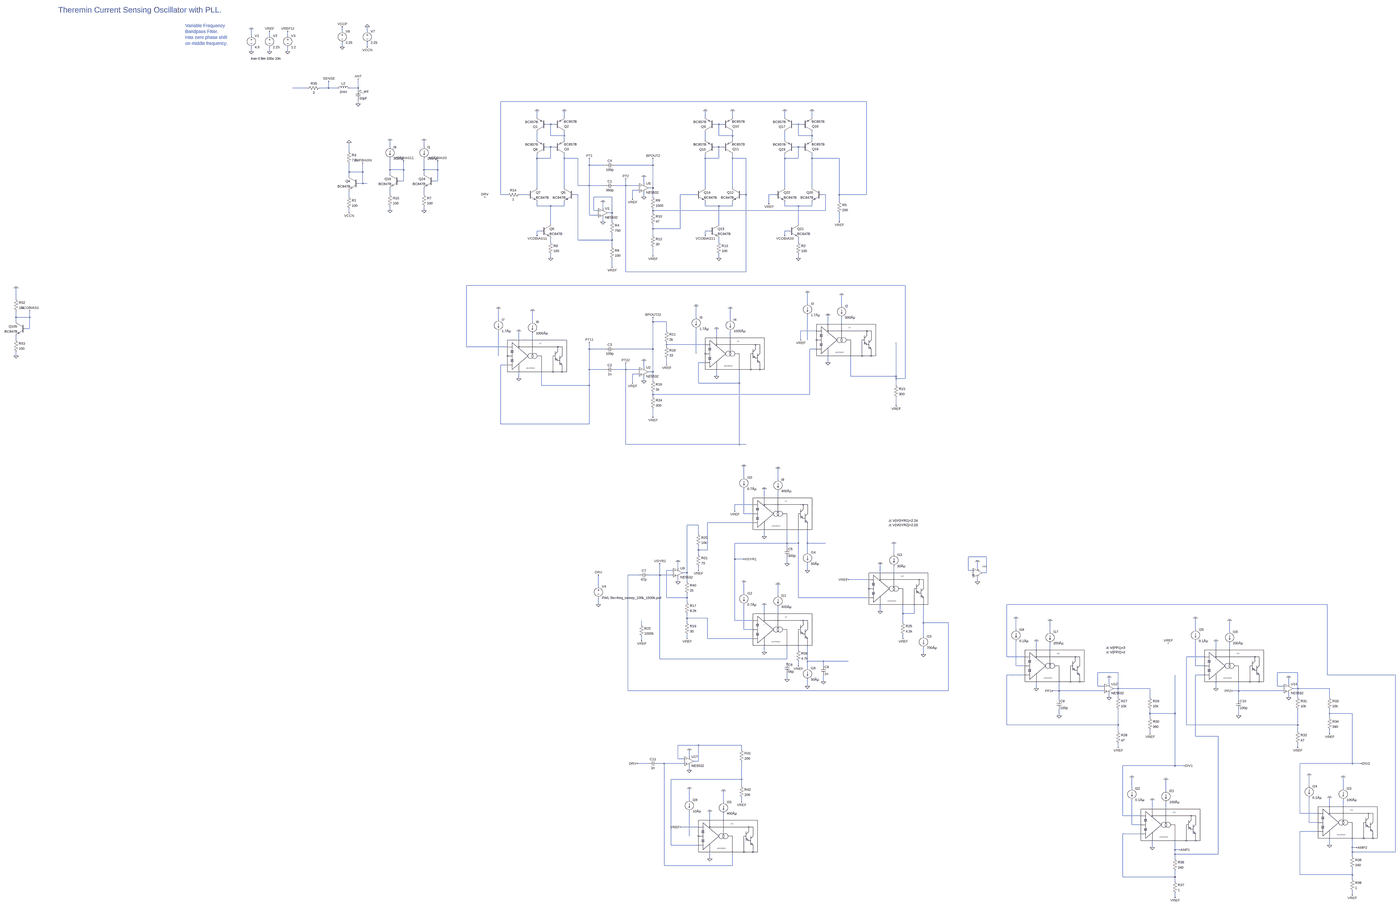
[diagram p0: schematic vco_and_lc_drive_v12.asc, whole sheet]
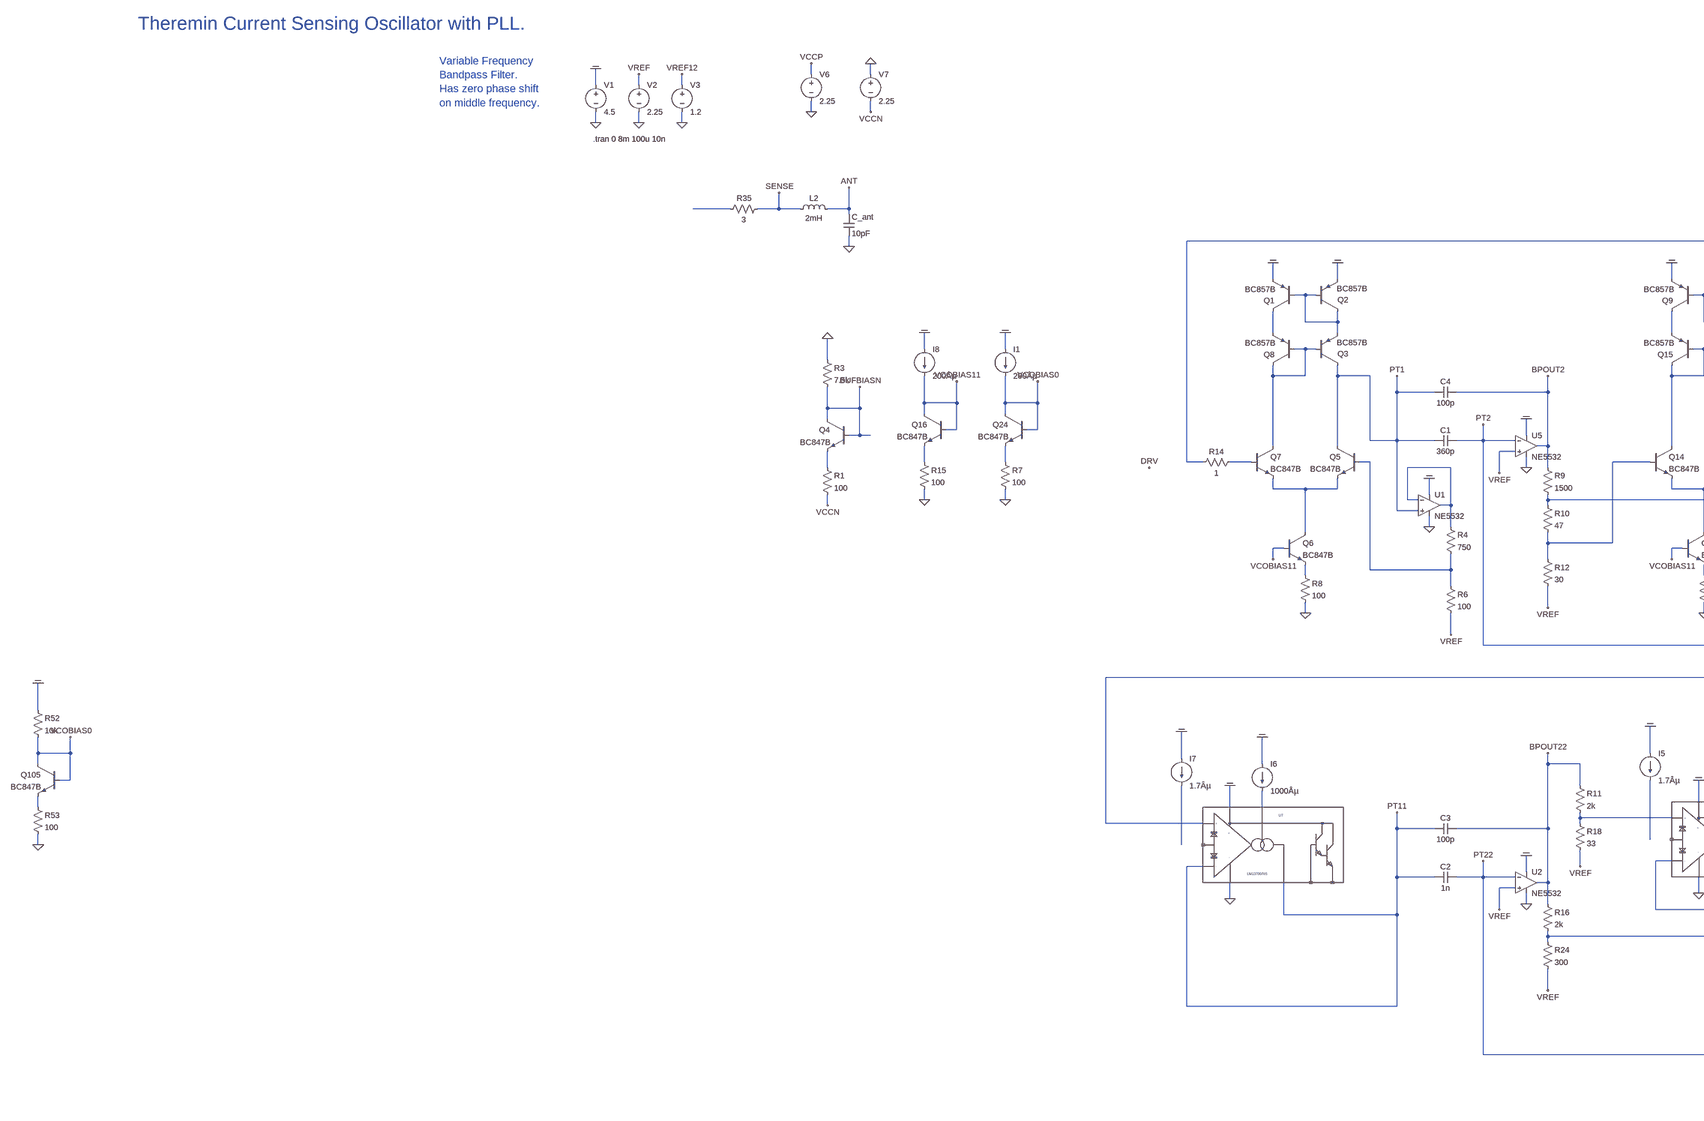
[diagram p1: schematic vco_and_lc_drive_v12.asc, part, row 1 of 2, column 1 of 2]
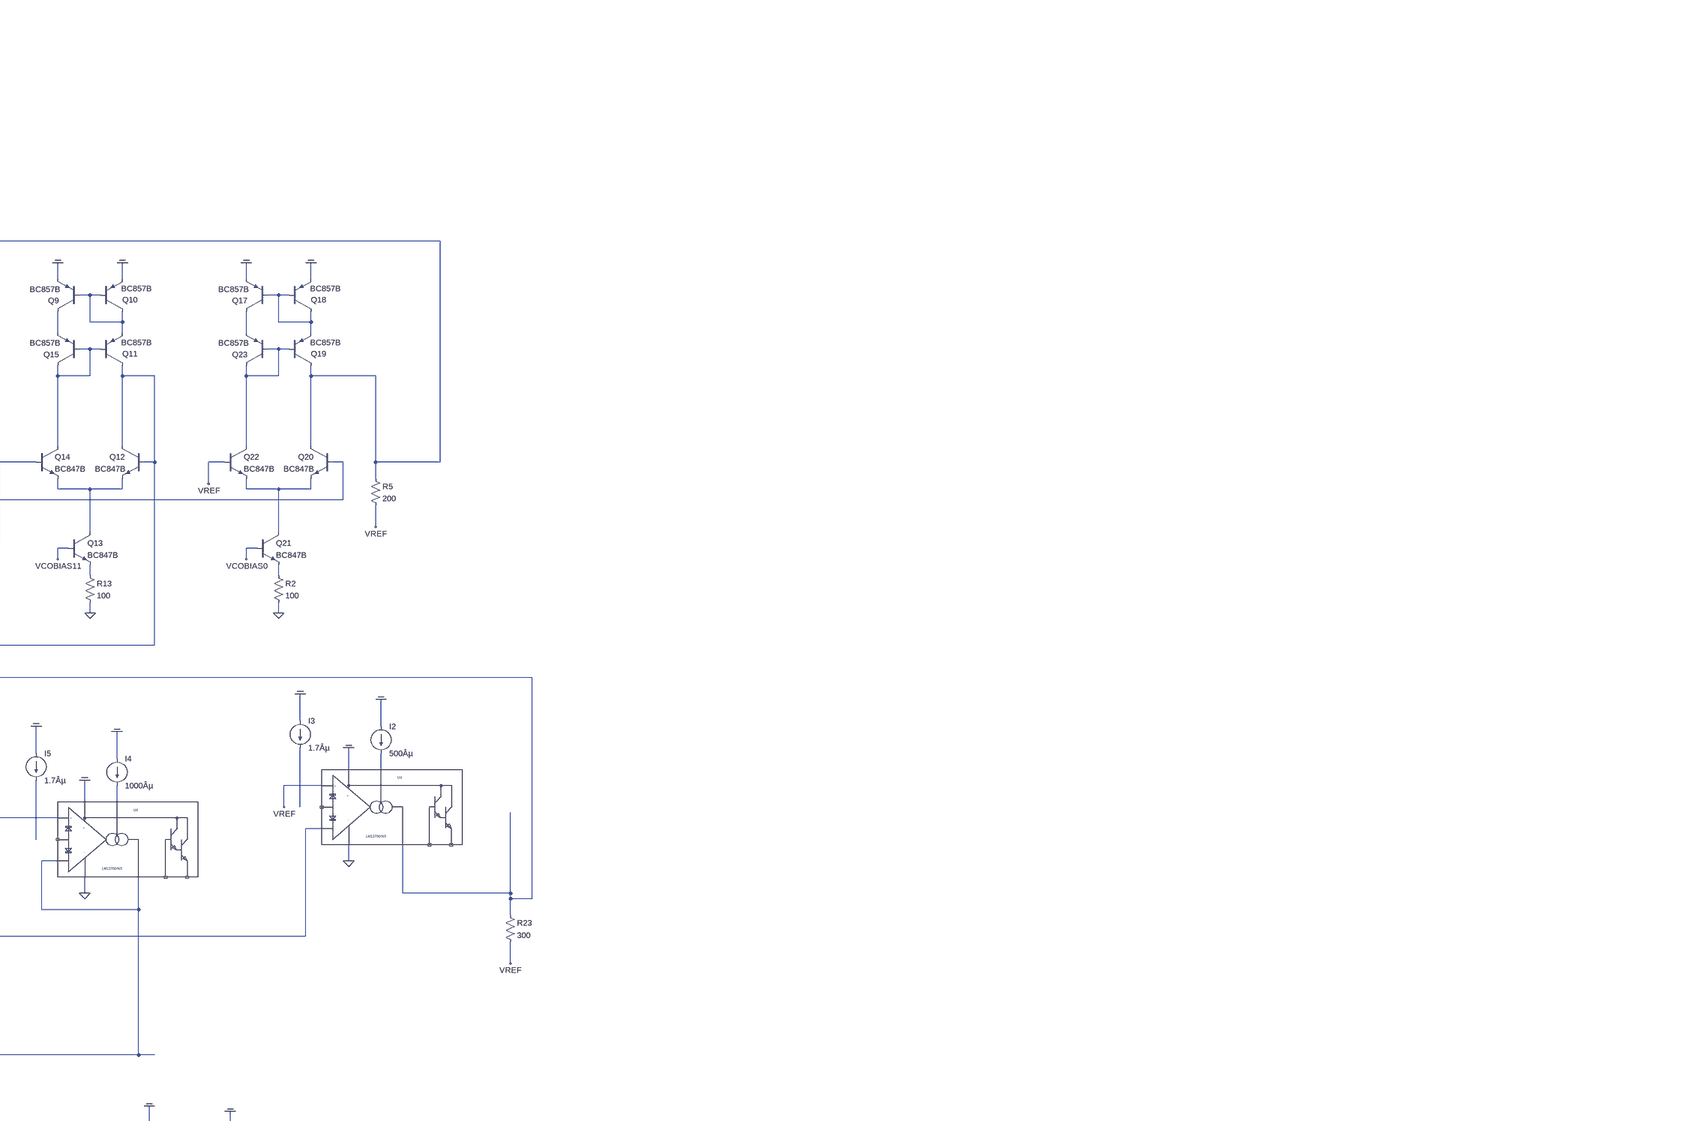
[diagram p2: schematic vco_and_lc_drive_v12.asc, part, row 1 of 2, column 2 of 2]
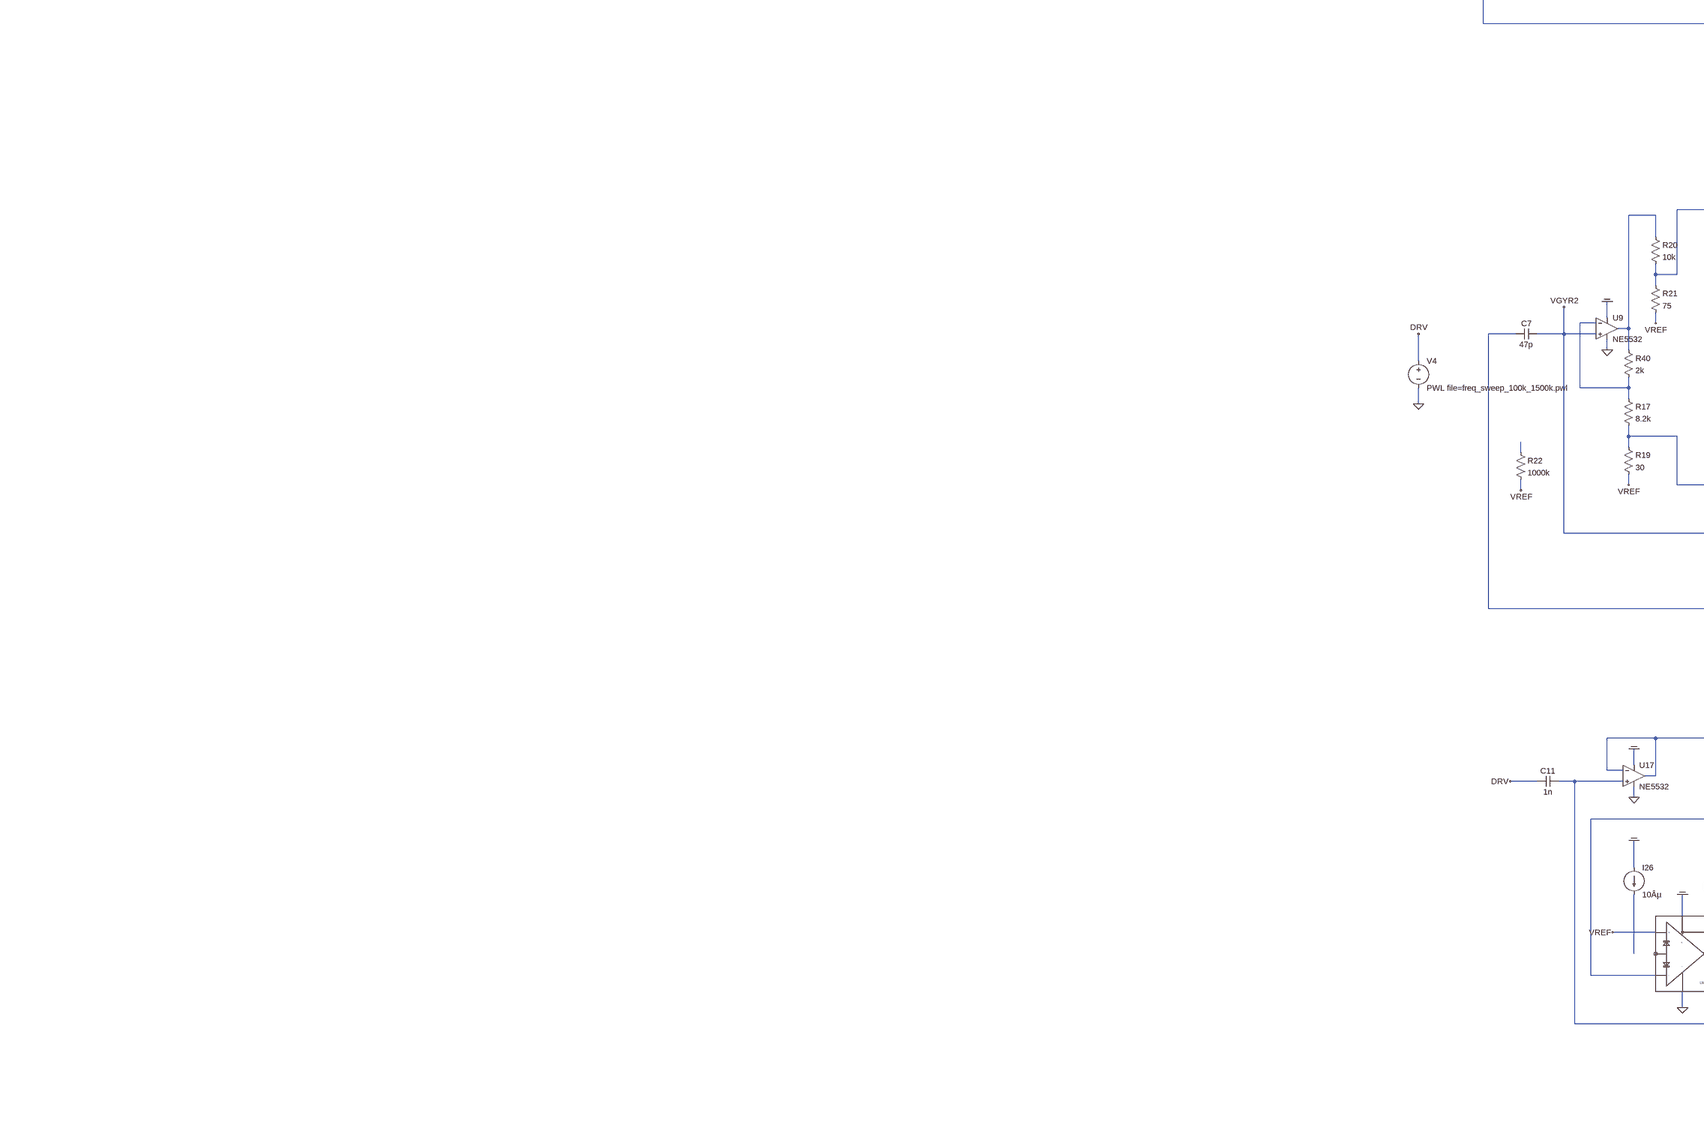
[diagram p3: schematic vco_and_lc_drive_v12.asc, part, row 2 of 2, column 1 of 2]
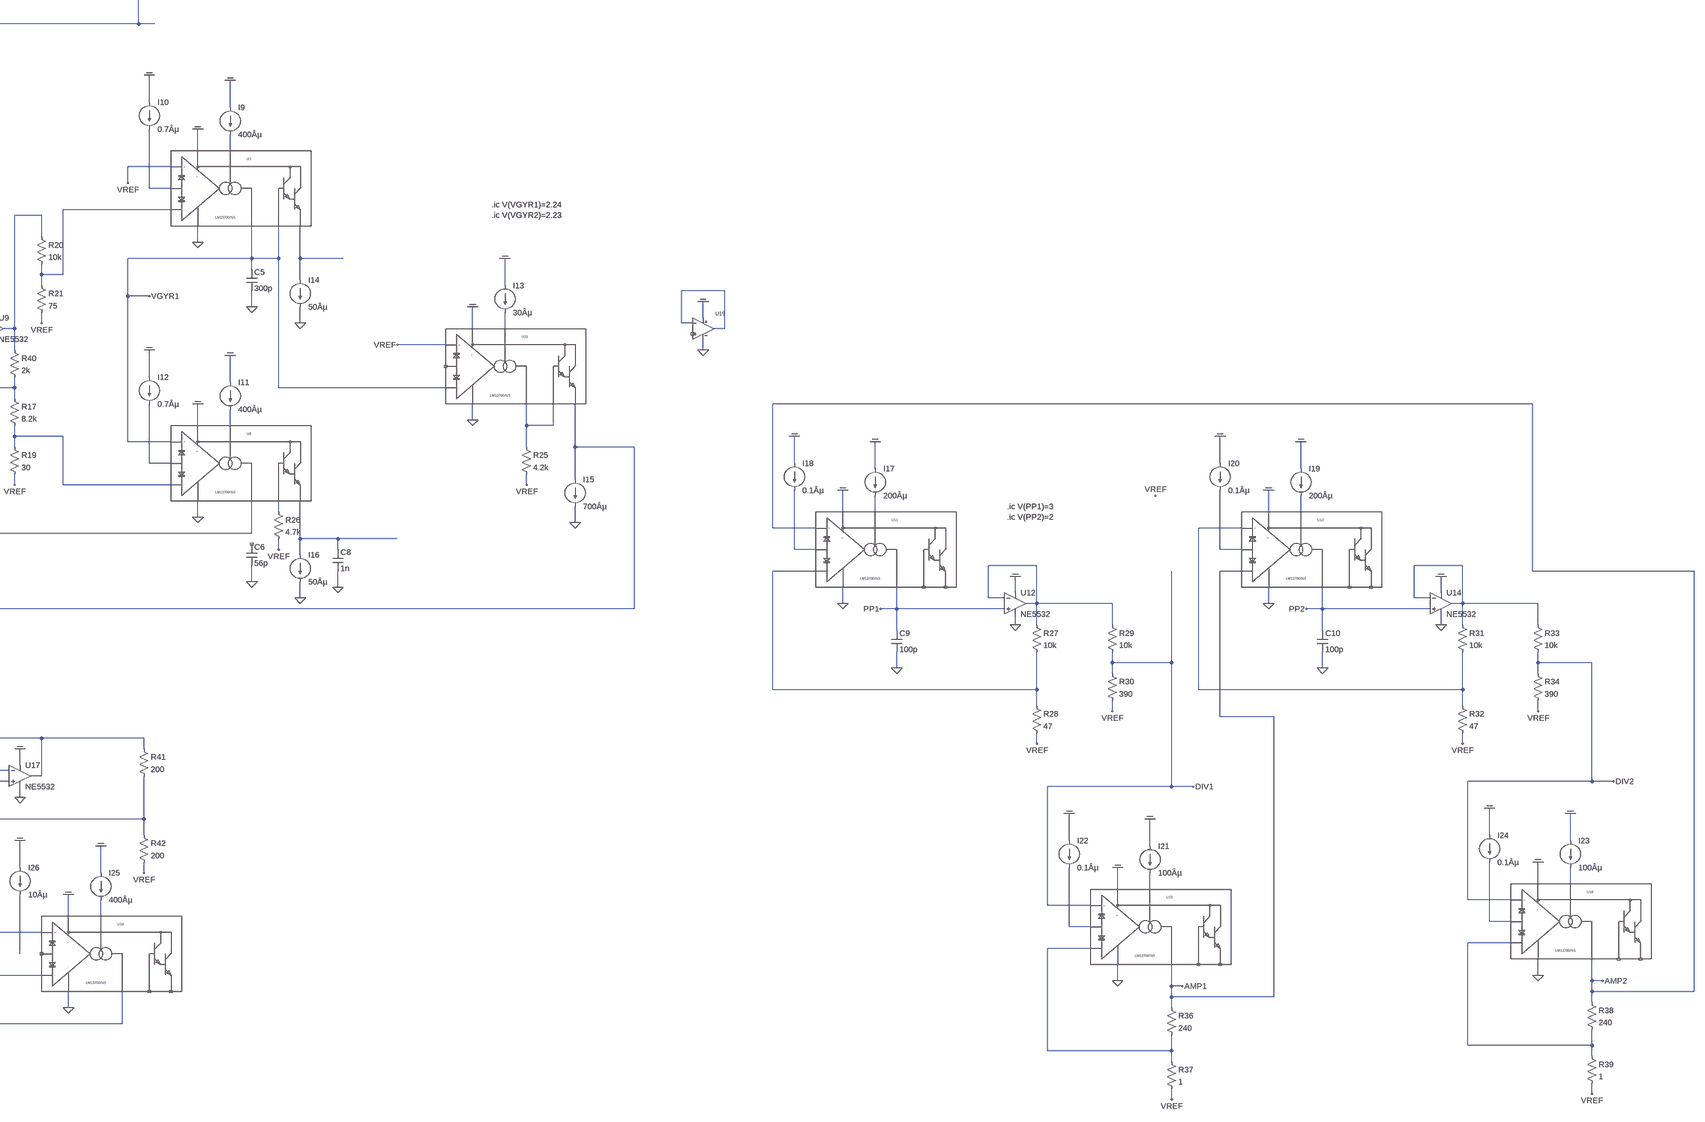
[diagram p4: schematic vco_and_lc_drive_v12.asc, part, row 2 of 2, column 2 of 2]
vco_and_lc_drive_v12.asc, the LTspice schematic file:
Version 4
SHEET 1 13504 25532
WIRE -4960 19040 -4960 19008
WIRE -4784 19040 -4784 19008
WIRE -5600 19072 -5600 19024
WIRE -5472 19072 -5472 19040
WIRE -5344 19072 -5344 19040
WIRE -4960 19152 -4960 19120
WIRE -4784 19152 -4784 19120
WIRE -5600 19184 -5600 19152
WIRE -5472 19184 -5472 19152
WIRE -5344 19184 -5344 19152
WIRE -5200 19440 -5312 19440
WIRE -5056 19440 -5056 19392
WIRE -5056 19440 -5120 19440
WIRE -4992 19440 -5056 19440
WIRE -4848 19440 -4848 19376
WIRE -4848 19440 -4912 19440
WIRE -4848 19456 -4848 19440
WIRE -336 19536 -2912 19536
WIRE -4848 19552 -4848 19520
WIRE -2656 19648 -2656 19600
WIRE -2464 19648 -2464 19600
WIRE -1472 19648 -1472 19600
WIRE -1280 19648 -1280 19600
WIRE -912 19648 -912 19600
WIRE -720 19648 -720 19600
WIRE -2560 19696 -2592 19696
WIRE -2528 19696 -2560 19696
WIRE -1376 19696 -1408 19696
WIRE -1344 19696 -1376 19696
WIRE -816 19696 -848 19696
WIRE -784 19696 -816 19696
WIRE -2560 19776 -2560 19696
WIRE -2464 19776 -2464 19744
WIRE -2464 19776 -2560 19776
WIRE -1376 19776 -1376 19696
WIRE -1280 19776 -1280 19744
WIRE -1280 19776 -1376 19776
WIRE -816 19776 -816 19696
WIRE -720 19776 -720 19744
WIRE -720 19776 -816 19776
WIRE -2656 19808 -2656 19744
WIRE -2464 19808 -2464 19776
WIRE -1472 19808 -1472 19744
WIRE -1280 19808 -1280 19776
WIRE -912 19808 -912 19744
WIRE -720 19808 -720 19776
WIRE -4624 19856 -4624 19808
WIRE -4384 19856 -4384 19808
WIRE -2560 19856 -2592 19856
WIRE -2528 19856 -2560 19856
WIRE -1376 19856 -1408 19856
WIRE -1344 19856 -1376 19856
WIRE -816 19856 -848 19856
WIRE -784 19856 -816 19856
WIRE -4912 19888 -4912 19824
WIRE -2656 19936 -2656 19904
WIRE -2560 19936 -2560 19856
WIRE -2560 19936 -2656 19936
WIRE -2464 19936 -2464 19904
WIRE -2368 19936 -2464 19936
WIRE -1472 19936 -1472 19904
WIRE -1376 19936 -1376 19856
WIRE -1376 19936 -1472 19936
WIRE -1280 19936 -1280 19904
WIRE -1184 19936 -1280 19936
WIRE -912 19936 -912 19904
WIRE -816 19936 -816 19856
WIRE -816 19936 -912 19936
WIRE -720 19936 -720 19904
WIRE -528 19936 -720 19936
WIRE -2288 19984 -2288 19936
WIRE -2176 19984 -2288 19984
WIRE -1840 19984 -1840 19936
WIRE -1840 19984 -2112 19984
WIRE -4624 20016 -4624 19936
WIRE -4528 20016 -4528 19952
WIRE -4528 20016 -4624 20016
WIRE -4384 20016 -4384 19936
WIRE -4288 20016 -4288 19952
WIRE -4288 20016 -4384 20016
WIRE -4912 20032 -4912 19968
WIRE -4816 20032 -4816 19968
WIRE -4816 20032 -4912 20032
WIRE -4624 20048 -4624 20016
WIRE -4384 20048 -4384 20016
WIRE -4912 20064 -4912 20032
WIRE -4528 20096 -4528 20016
WIRE -4528 20096 -4560 20096
WIRE -4288 20096 -4288 20016
WIRE -4288 20096 -4320 20096
WIRE -4816 20112 -4816 20032
WIRE -4816 20112 -4848 20112
WIRE -4784 20112 -4816 20112
WIRE -1904 20112 -1904 20064
WIRE -2368 20128 -2368 19936
WIRE -2288 20128 -2288 19984
WIRE -2288 20128 -2368 20128
WIRE -2176 20128 -2288 20128
WIRE -2032 20128 -2032 20080
WIRE -2032 20128 -2112 20128
WIRE -1936 20128 -2032 20128
WIRE -2656 20144 -2656 19936
WIRE -2464 20144 -2464 19936
WIRE -1840 20144 -1840 19984
WIRE -1840 20144 -1872 20144
WIRE -1472 20144 -1472 19936
WIRE -1280 20144 -1280 19936
WIRE -912 20144 -912 19936
WIRE -720 20144 -720 19936
WIRE -1936 20160 -1984 20160
WIRE -4624 20192 -4624 20144
WIRE -4384 20192 -4384 20144
WIRE -2912 20192 -2912 19536
WIRE -2864 20192 -2912 20192
WIRE -2720 20192 -2784 20192
WIRE -2368 20192 -2400 20192
WIRE -1536 20192 -1648 20192
WIRE -1184 20192 -1184 19936
WIRE -1184 20192 -1216 20192
WIRE -976 20192 -1024 20192
WIRE -624 20192 -656 20192
WIRE -528 20192 -528 19936
WIRE -336 20192 -336 19536
WIRE -336 20192 -528 20192
WIRE -4912 20208 -4912 20160
WIRE -2128 20208 -2256 20208
WIRE -1904 20208 -1904 20176
WIRE -1840 20208 -1840 20144
WIRE -1984 20224 -1984 20160
WIRE -528 20240 -528 20192
WIRE -1024 20256 -1024 20192
WIRE -2656 20272 -2656 20240
WIRE -2560 20272 -2656 20272
WIRE -2464 20272 -2464 20240
WIRE -2464 20272 -2560 20272
WIRE -1472 20272 -1472 20240
WIRE -1376 20272 -1472 20272
WIRE -1280 20272 -1280 20240
WIRE -1280 20272 -1376 20272
WIRE -912 20272 -912 20240
WIRE -816 20272 -912 20272
WIRE -720 20272 -720 20240
WIRE -720 20272 -816 20272
WIRE -2192 20288 -2192 20240
WIRE -4624 20304 -4624 20272
WIRE -4384 20304 -4384 20272
WIRE -2256 20304 -2256 20208
WIRE -2224 20304 -2256 20304
WIRE -1840 20304 -1840 20288
WIRE -624 20304 -624 20192
WIRE -624 20304 -1840 20304
WIRE -4912 20320 -4912 20288
WIRE -2128 20320 -2128 20208
WIRE -2128 20320 -2160 20320
WIRE -1840 20320 -1840 20304
WIRE -2288 20336 -2288 20128
WIRE -2224 20336 -2288 20336
WIRE -2192 20384 -2192 20352
WIRE -2128 20384 -2128 20320
WIRE -528 20384 -528 20320
WIRE -2560 20400 -2560 20272
WIRE -1376 20400 -1376 20272
WIRE -816 20400 -816 20272
WIRE -1840 20432 -1840 20400
WIRE -1648 20432 -1648 20192
WIRE -1648 20432 -1840 20432
WIRE -2624 20448 -2656 20448
WIRE -1440 20448 -1472 20448
WIRE -880 20448 -912 20448
WIRE -2656 20480 -2656 20448
WIRE -1840 20480 -1840 20432
WIRE -1472 20480 -1472 20448
WIRE -912 20480 -912 20448
WIRE -2368 20512 -2368 20192
WIRE -2128 20512 -2128 20464
WIRE -2128 20512 -2368 20512
WIRE -2560 20528 -2560 20496
WIRE -1376 20528 -1376 20496
WIRE -816 20528 -816 20496
WIRE -2128 20560 -2128 20512
WIRE -1840 20624 -1840 20560
WIRE -2560 20640 -2560 20608
WIRE -1376 20640 -1376 20608
WIRE -816 20640 -816 20608
WIRE -2128 20704 -2128 20640
WIRE -2032 20736 -2032 20128
WIRE -1184 20736 -1184 20192
WIRE -1184 20736 -2032 20736
WIRE -64 20832 -3152 20832
WIRE -7904 20928 -7904 20848
WIRE -752 20960 -752 20880
WIRE -512 20976 -512 20896
WIRE -7904 21056 -7904 21008
WIRE -7808 21056 -7808 21008
WIRE -7808 21056 -7904 21056
WIRE -1536 21056 -1536 20976
WIRE -2928 21072 -2928 20992
WIRE -1296 21072 -1296 20992
WIRE -7904 21088 -7904 21056
WIRE -2688 21088 -2688 21008
WIRE -1840 21088 -1840 21056
WIRE -1744 21088 -1840 21088
WIRE -608 21104 -608 21040
WIRE -512 21104 -512 21056
WIRE -7808 21136 -7808 21056
WIRE -7808 21136 -7840 21136
WIRE -1744 21152 -1744 21088
WIRE -688 21152 -800 21152
WIRE -1392 21200 -1392 21136
WIRE -1296 21200 -1296 21152
WIRE -7904 21216 -7904 21184
WIRE -2784 21216 -2784 21152
WIRE -2688 21216 -2688 21168
WIRE -800 21216 -800 21152
WIRE -752 21216 -752 21040
WIRE -1744 21248 -1744 21232
WIRE -1472 21248 -1744 21248
WIRE -3152 21264 -3152 20832
WIRE -2864 21264 -3152 21264
WIRE -1744 21264 -1744 21248
WIRE -2288 21280 -2288 21232
WIRE -2176 21280 -2288 21280
WIRE -1840 21280 -1840 21088
WIRE -1840 21280 -2112 21280
WIRE -688 21280 -736 21280
WIRE -1536 21312 -1536 21136
WIRE -7904 21328 -7904 21296
WIRE -2928 21328 -2928 21152
WIRE -1472 21376 -1520 21376
WIRE -608 21376 -608 21328
WIRE -2864 21392 -2912 21392
WIRE -1744 21392 -1744 21344
WIRE -1904 21408 -1904 21360
WIRE -2288 21424 -2288 21280
WIRE -2176 21424 -2288 21424
WIRE -2032 21424 -2032 21376
WIRE -2032 21424 -2112 21424
WIRE -1936 21424 -2032 21424
WIRE -1840 21440 -1840 21280
WIRE -1840 21440 -1872 21440
WIRE -1936 21456 -1984 21456
WIRE -1392 21472 -1392 21424
WIRE -448 21472 -448 21328
WIRE -128 21472 -128 21232
WIRE -128 21472 -448 21472
WIRE -2784 21488 -2784 21440
WIRE -128 21488 -128 21472
WIRE -64 21488 -64 20832
WIRE -64 21488 -128 21488
WIRE -1904 21504 -1904 21472
WIRE -1840 21504 -1840 21440
WIRE -1984 21520 -1984 21456
WIRE -1520 21520 -1520 21376
WIRE -1232 21520 -1232 21424
WIRE -1232 21520 -1520 21520
WIRE -2624 21536 -2624 21440
WIRE -2288 21536 -2288 21424
WIRE -2288 21536 -2624 21536
WIRE -128 21536 -128 21488
WIRE -1840 21600 -1840 21584
WIRE -736 21600 -736 21280
WIRE -736 21600 -1840 21600
WIRE -1840 21616 -1840 21600
WIRE -128 21680 -128 21616
WIRE -1840 21760 -1840 21696
WIRE -2912 21808 -2912 21392
WIRE -2288 21808 -2288 21536
WIRE -2288 21808 -2912 21808
WIRE -2032 22032 -2032 21424
WIRE -1232 22032 -1232 21520
WIRE -1232 22032 -2032 22032
WIRE -1184 22032 -1232 22032
WIRE -1200 22480 -1200 22400
WIRE -960 22496 -960 22416
WIRE -1056 22624 -1056 22560
WIRE -960 22624 -960 22576
WIRE -1136 22672 -1264 22672
WIRE -1264 22720 -1264 22672
WIRE -1200 22736 -1200 22560
WIRE -1136 22736 -1200 22736
WIRE -1136 22800 -1456 22800
WIRE -1520 22816 -1600 22816
WIRE -1520 22880 -1520 22816
WIRE -1056 22896 -1056 22848
WIRE -896 22944 -896 22848
WIRE -896 22944 -1264 22944
WIRE -816 22944 -816 22848
WIRE -816 22944 -896 22944
WIRE -752 22944 -752 22848
WIRE -624 22944 -752 22944
WIRE -896 22976 -896 22944
WIRE -1520 22992 -1520 22960
WIRE -1456 22992 -1456 22800
WIRE -1456 22992 -1520 22992
WIRE -752 23008 -752 22944
WIRE -1520 23024 -1520 22992
WIRE -144 23024 -144 22944
WIRE 544 23040 416 23040
WIRE -1264 23056 -1264 22944
WIRE -1200 23056 -1264 23056
WIRE -896 23088 -896 23040
WIRE -1664 23120 -1664 23072
WIRE 480 23120 480 23072
WIRE -1696 23136 -1744 23136
WIRE -1520 23136 -1520 23104
WIRE -752 23136 -752 23088
WIRE 416 23136 416 23040
WIRE 448 23136 416 23136
WIRE -1600 23152 -1600 22816
WIRE -1600 23152 -1632 23152
WIRE -240 23152 -240 23088
WIRE -144 23152 -144 23104
WIRE 544 23152 544 23040
WIRE 544 23152 512 23152
WIRE -1936 23168 -2016 23168
WIRE -1792 23168 -1792 23088
WIRE -1792 23168 -1872 23168
WIRE -1696 23168 -1792 23168
WIRE -320 23200 -464 23200
WIRE -1664 23216 -1664 23184
WIRE -1600 23216 -1600 23152
WIRE 480 23216 480 23184
WIRE -2224 23248 -2224 23168
WIRE -1200 23296 -1200 23216
WIRE -960 23312 -960 23232
WIRE -1744 23328 -1744 23136
WIRE -1600 23328 -1600 23296
WIRE -1600 23328 -1744 23328
WIRE -816 23328 -816 22944
WIRE -320 23328 -816 23328
WIRE -1600 23360 -1600 23328
WIRE -2224 23376 -2224 23328
WIRE 3328 23376 1072 23376
WIRE -240 23424 -240 23376
WIRE -1056 23440 -1056 23376
WIRE -960 23440 -960 23392
WIRE -80 23440 -80 23376
WIRE 0 23440 0 23376
WIRE 0 23440 -80 23440
WIRE -1600 23472 -1600 23440
WIRE -1456 23472 -1600 23472
WIRE -1264 23488 -1264 23056
WIRE -1136 23488 -1264 23488
WIRE -1600 23504 -1600 23472
WIRE -80 23504 -80 23440
WIRE 64 23504 64 23376
WIRE 240 23504 64 23504
WIRE -1920 23520 -1920 23488
WIRE -1200 23552 -1200 23376
WIRE -1136 23552 -1200 23552
WIRE 1136 23552 1136 23472
WIRE 2400 23552 2400 23472
WIRE 1376 23568 1376 23488
WIRE 2640 23568 2640 23488
WIRE 64 23600 64 23504
WIRE -1600 23616 -1600 23584
WIRE -1456 23616 -1456 23472
WIRE -1136 23616 -1456 23616
WIRE -80 23616 -80 23584
WIRE -1920 23632 -1920 23600
WIRE -816 23696 -816 23664
WIRE 1280 23696 1280 23632
WIRE 1376 23696 1376 23648
WIRE 2544 23696 2544 23632
WIRE 2640 23696 2640 23648
WIRE -1056 23712 -1056 23664
WIRE 64 23728 64 23680
WIRE 1072 23744 1072 23376
WIRE 1200 23744 1072 23744
WIRE 2464 23744 2336 23744
WIRE -1792 23760 -1792 23168
WIRE -896 23760 -896 23664
WIRE -896 23760 -1792 23760
WIRE -752 23776 -752 23664
WIRE -640 23776 -752 23776
WIRE -464 23776 -640 23776
WIRE -816 23808 -816 23776
WIRE -640 23808 -640 23776
WIRE 1136 23808 1136 23632
WIRE 1200 23808 1136 23808
WIRE 2400 23808 2400 23632
WIRE 2464 23808 2400 23808
WIRE -752 23824 -752 23776
WIRE 1856 23856 1712 23856
WIRE 3120 23856 2976 23856
WIRE 1200 23872 1072 23872
WIRE 2464 23872 2400 23872
WIRE 3328 23872 3328 23376
WIRE 3808 23872 3328 23872
WIRE -896 23904 -896 23856
WIRE -640 23920 -640 23872
WIRE 1792 23936 1792 23888
WIRE 3056 23936 3056 23888
WIRE -752 23952 -752 23904
WIRE 1712 23952 1712 23856
WIRE 1760 23952 1712 23952
WIRE 2976 23952 2976 23856
WIRE 3024 23952 2976 23952
WIRE 1280 23968 1280 23920
WIRE 1856 23968 1856 23856
WIRE 1856 23968 1824 23968
WIRE 2080 23968 1856 23968
WIRE 2544 23968 2544 23920
WIRE 3120 23968 3120 23856
WIRE 3120 23968 3088 23968
WIRE 3344 23968 3120 23968
WIRE -2016 23984 -2016 23168
WIRE 240 23984 240 23504
WIRE 240 23984 -2016 23984
WIRE 1440 23984 1440 23920
WIRE 1440 23984 1392 23984
WIRE 1760 23984 1440 23984
WIRE 2704 23984 2704 23920
WIRE 2704 23984 2656 23984
WIRE 3024 23984 2704 23984
WIRE 1792 24032 1792 24000
WIRE 1856 24032 1856 23968
WIRE 2080 24032 2080 23968
WIRE 3056 24032 3056 24000
WIRE 3120 24032 3120 23968
WIRE 3344 24032 3344 23968
WIRE 1440 24048 1440 23984
WIRE 2704 24048 2704 23984
WIRE 2080 24144 2080 24112
WIRE 2256 24144 2256 23872
WIRE 2256 24144 2080 24144
WIRE 3344 24144 3344 24112
WIRE 3504 24144 3344 24144
WIRE 1440 24160 1440 24112
WIRE 2704 24160 2704 24112
WIRE 2080 24176 2080 24144
WIRE 3344 24176 3344 24144
WIRE 1072 24224 1072 23872
WIRE 1856 24224 1856 24112
WIRE 1856 24224 1072 24224
WIRE 2336 24224 2336 23744
WIRE 3120 24224 3120 24112
WIRE 3120 24224 2336 24224
WIRE 1856 24272 1856 24224
WIRE 3120 24272 3120 24224
WIRE 2080 24288 2080 24256
WIRE 3344 24288 3344 24256
WIRE 2400 24304 2400 23872
WIRE 2560 24304 2400 24304
WIRE -1520 24368 -1664 24368
WIRE -1216 24368 -1520 24368
WIRE 1856 24384 1856 24352
WIRE 3120 24384 3120 24352
WIRE -1216 24400 -1216 24368
WIRE -1584 24448 -1584 24400
WIRE -1664 24464 -1664 24368
WIRE -1616 24464 -1664 24464
WIRE -1520 24480 -1520 24368
WIRE -1520 24480 -1552 24480
WIRE -1872 24496 -1952 24496
WIRE -1760 24496 -1808 24496
WIRE -1616 24496 -1760 24496
WIRE 3504 24496 3504 24144
WIRE 3504 24496 3136 24496
WIRE 3568 24496 3504 24496
WIRE 2256 24512 2256 24144
WIRE 2256 24512 1888 24512
WIRE 2320 24512 2256 24512
WIRE -1584 24544 -1584 24512
WIRE -1216 24608 -1216 24480
WIRE -1216 24608 -1712 24608
WIRE -1216 24656 -1216 24608
WIRE 3200 24656 3200 24576
WIRE 1952 24672 1952 24592
WIRE 3440 24672 3440 24592
WIRE 2192 24688 2192 24608
WIRE -1584 24752 -1584 24672
WIRE -1344 24768 -1344 24688
WIRE -1216 24768 -1216 24736
WIRE 3344 24800 3344 24736
WIRE 3440 24800 3440 24752
WIRE 2096 24816 2096 24752
WIRE 2192 24816 2192 24768
WIRE 3136 24848 3136 24496
WIRE 3264 24848 3136 24848
WIRE 1888 24864 1888 24512
WIRE 2016 24864 1888 24864
WIRE -1440 24896 -1440 24832
WIRE -1344 24896 -1344 24848
WIRE 3200 24912 3200 24736
WIRE 3264 24912 3200 24912
WIRE 1952 24928 1952 24752
WIRE 2016 24928 1952 24928
WIRE -1520 24944 -1648 24944
WIRE 3264 24976 3136 24976
WIRE 2016 24992 1888 24992
WIRE -1584 25008 -1584 24832
WIRE -1712 25072 -1712 24608
WIRE -1520 25072 -1712 25072
WIRE 3344 25072 3344 25024
WIRE 2096 25088 2096 25040
WIRE 3504 25088 3504 25024
WIRE 3536 25088 3504 25088
WIRE 2256 25104 2256 25040
WIRE 2288 25104 2256 25104
WIRE 3504 25120 3504 25088
WIRE 3808 25120 3808 23872
WIRE 3808 25120 3504 25120
WIRE 2256 25136 2256 25104
WIRE 2560 25136 2560 24304
WIRE 2560 25136 2256 25136
WIRE 3504 25152 3504 25120
WIRE -1440 25168 -1440 25120
WIRE 2256 25168 2256 25136
WIRE -1760 25216 -1760 24496
WIRE -1280 25216 -1280 25120
WIRE -1280 25216 -1760 25216
WIRE 3136 25280 3136 24976
WIRE 3504 25280 3504 25232
WIRE 3504 25280 3136 25280
WIRE 1888 25296 1888 24992
WIRE 2256 25296 2256 25248
WIRE 2256 25296 1888 25296
WIRE 3504 25312 3504 25280
WIRE 2256 25328 2256 25296
WIRE 3504 25424 3504 25392
WIRE 2256 25440 2256 25408
FLAG -5600 19184 0
FLAG -5600 19024 COM
FLAG -5472 19184 0
FLAG -5472 19040 VREF
FLAG -4848 19376 ANT
FLAG -5056 19392 SENSE
FLAG -5344 19184 0
FLAG -5344 19040 VREF12
FLAG -7904 20848 COM
FLAG -7904 21328 0
FLAG -7808 21008 VCOBIAS0
FLAG -4960 19152 0
FLAG -4960 19008 VCCP
FLAG -4784 19008 0
FLAG -4784 19152 VCCN
FLAG -4912 20320 VCCN
FLAG -4912 19824 0
FLAG -4816 19968 BUFBIASN
FLAG -2656 19600 COM
FLAG -2464 19600 COM
FLAG -2656 20480 VCOBIAS11
FLAG -2560 20640 0
FLAG -1904 20208 0
FLAG -1904 20064 COM
FLAG -1984 20224 VREF
FLAG -1840 20624 VREF
FLAG -1840 19936 BPOUT2
FLAG -1472 19600 COM
FLAG -1280 19600 COM
FLAG -1472 20480 VCOBIAS11
FLAG -1376 20640 0
FLAG -3024 20208 DRV
FLAG -4848 19552 0
FLAG -4624 20304 0
FLAG -4528 19952 VCOBIAS11
FLAG -4624 19808 COM
FLAG -2192 20384 0
FLAG -2192 20240 COM
FLAG -2128 20704 VREF
FLAG -912 19600 COM
FLAG -720 19600 COM
FLAG -912 20480 VCOBIAS0
FLAG -816 20640 0
FLAG -1024 20256 VREF
FLAG -528 20384 VREF
FLAG -4384 20304 0
FLAG -4288 19952 VCOBIAS0
FLAG -4384 19808 COM
FLAG -2288 19936 PT1
FLAG -2032 20080 PT2
FLAG -1904 21504 0
FLAG -1904 21360 COM
FLAG -1984 21520 VREF
FLAG -1840 21760 VREF
FLAG -1840 21056 BPOUT22
FLAG -128 21680 VREF
FLAG -2288 21232 PT11
FLAG -2032 21376 PT22
FLAG -608 21376 0
FLAG -608 21040 COM
FLAG -512 20896 COM
FLAG -800 21216 VREF
FLAG -752 20880 COM
FLAG -1392 21472 0
FLAG -1392 21136 COM
FLAG -1296 20992 COM
FLAG -1536 20976 COM
FLAG -2784 21488 0
FLAG -2784 21152 COM
FLAG -2688 21008 COM
FLAG -2928 20992 COM
FLAG -1744 21392 VREF
FLAG -1056 22896 0
FLAG -1056 22560 COM
FLAG -960 22416 COM
FLAG -1200 22400 COM
FLAG -1264 22720 VREF
FLAG -896 23088 0
FLAG -1056 23712 0
FLAG -1056 23376 COM
FLAG -960 23232 COM
FLAG -1200 23216 COM
FLAG -896 23904 0
FLAG -1664 23216 0
FLAG -1664 23072 COM
FLAG -1600 23616 VREF
FLAG -2224 23376 0
FLAG -1520 23136 VREF
FLAG -1920 23632 VREF
FLAG -240 23424 0
FLAG -240 23088 COM
FLAG -144 22944 COM
FLAG -80 23616 VREF
FLAG 64 23728 0
FLAG -1200 23056 VGYR1
FLAG -1792 23088 VGYR2
FLAG -816 23808 VREF
FLAG -752 23952 0
FLAG -640 23920 0
FLAG -752 23136 0
FLAG -464 23200 VREF
FLAG 1280 23968 0
FLAG 1280 23632 COM
FLAG 1376 23488 COM
FLAG 1136 23472 COM
FLAG 1440 24160 0
FLAG 1792 24032 0
FLAG 1792 23888 COM
FLAG 1856 24384 VREF
FLAG 2080 24288 VREF
FLAG 2544 23968 0
FLAG 2544 23632 COM
FLAG 2640 23488 COM
FLAG 2400 23472 COM
FLAG 2704 24160 0
FLAG 3056 24032 0
FLAG 3056 23888 COM
FLAG 3120 24384 VREF
FLAG 3344 24288 VREF
FLAG 2208 23648 VREF
FLAG 1392 23984 PP1
FLAG 2656 23984 PP2
FLAG 2096 25088 0
FLAG 2096 24752 COM
FLAG 2192 24608 COM
FLAG 1952 24592 COM
FLAG 2256 25440 VREF
FLAG 2288 25104 AMP1
FLAG 2320 24512 DIV1
FLAG 3344 25072 0
FLAG 3344 24736 COM
FLAG 3440 24592 COM
FLAG 3200 24576 COM
FLAG 3504 25424 VREF
FLAG 3536 25088 AMP2
FLAG 3568 24496 DIV2
FLAG -2224 23168 DRV
FLAG -1952 24496 DRV
FLAG -1584 24544 0
FLAG -1584 24400 COM
FLAG -1440 25168 0
FLAG -1440 24832 COM
FLAG -1344 24688 COM
FLAG -1584 24672 COM
FLAG -1648 24944 VREF
FLAG -1216 24768 VREF
FLAG 480 23216 0
FLAG 480 23072 COM
SYMBOL voltage -5600 19056 R0
SYMATTR InstName V1
SYMATTR Value 4.5
SYMBOL Voltage -5472 19056 R0
SYMATTR InstName V2
SYMATTR Value 2.25
SYMBOL ind -5008 19456 R270
WINDOW 0 32 56 VTop 2
WINDOW 3 5 56 VBottom 2
SYMATTR InstName L2
SYMATTR Value 2mH
SYMATTR SpiceLine Rser=120 Cpar=1pF
SYMBOL Cap -4864 19456 R0
SYMATTR InstName C_ant
SYMATTR Value 10pF
SYMBOL Res -5216 19456 R270
WINDOW 0 32 56 VTop 2
WINDOW 3 0 56 VBottom 2
SYMATTR InstName R35
SYMATTR Value 3
SYMBOL Voltage -5344 19056 R0
SYMATTR InstName V3
SYMATTR Value 1.2
SYMBOL npn -7840 21088 M0
SYMATTR InstName Q105
SYMATTR Value BC847B
SYMBOL Res -7920 20912 R0
SYMATTR InstName R52
SYMATTR Value 10k
SYMBOL Res -7920 21200 R0
SYMATTR InstName R53
SYMATTR Value 100
SYMBOL Voltage -4960 19024 R0
SYMATTR InstName V6
SYMATTR Value 2.25
SYMBOL Voltage -4784 19024 R0
SYMATTR InstName V7
SYMATTR Value 2.25
SYMBOL npn -4848 20064 M0
SYMATTR InstName Q4
SYMATTR Value BC847B
SYMBOL Res -4928 20192 R0
SYMATTR InstName R1
SYMATTR Value 100
SYMBOL Res -4928 19872 R0
SYMATTR InstName R3
SYMATTR Value 7.5k
SYMBOL pnp -2592 19744 R180
WINDOW 0 60 32 Left 2
WINDOW 3 58 66 Left 2
SYMATTR InstName Q1
SYMATTR Value BC857B
SYMBOL pnp -2528 19744 M180
WINDOW 0 64 34 Left 2
WINDOW 3 61 68 Left 2
SYMATTR InstName Q2
SYMATTR Value BC857B
SYMBOL pnp -2528 19904 M180
WINDOW 0 64 34 Left 2
WINDOW 3 61 68 Left 2
SYMATTR InstName Q3
SYMATTR Value BC857B
SYMBOL npn -2400 20144 M0
SYMATTR InstName Q5
SYMATTR Value BC847B
SYMBOL npn -2624 20400 R0
SYMATTR InstName Q6
SYMATTR Value BC847B
SYMBOL npn -2720 20144 R0
SYMATTR InstName Q7
SYMATTR Value BC847B
SYMBOL Res -2576 20512 R0
SYMATTR InstName R8
SYMATTR Value 100
SYMBOL pnp -2592 19904 R180
WINDOW 0 60 32 Left 2
WINDOW 3 58 66 Left 2
SYMATTR InstName Q8
SYMATTR Value BC857B
SYMBOL Cap -2112 20112 R90
WINDOW 0 0 32 VBottom 2
WINDOW 3 32 32 VTop 2
SYMATTR InstName C1
SYMATTR Value 360p
SYMBOL Cap -2112 19968 R90
WINDOW 0 0 32 VBottom 2
WINDOW 3 32 32 VTop 2
SYMATTR InstName C4
SYMATTR Value 100p
SYMBOL NE5532 -1904 20144 R0
SYMATTR InstName U5
SYMBOL Res -1856 20192 R0
SYMATTR InstName R9
SYMATTR Value 1500
SYMBOL Res -1856 20464 R0
SYMATTR InstName R12
SYMATTR Value 30
SYMBOL pnp -1408 19744 R180
WINDOW 0 60 32 Left 2
WINDOW 3 58 66 Left 2
SYMATTR InstName Q9
SYMATTR Value BC857B
SYMBOL pnp -1344 19744 M180
WINDOW 0 64 34 Left 2
WINDOW 3 61 68 Left 2
SYMATTR InstName Q10
SYMATTR Value BC857B
SYMBOL pnp -1344 19904 M180
WINDOW 0 64 34 Left 2
WINDOW 3 61 68 Left 2
SYMATTR InstName Q11
SYMATTR Value BC857B
SYMBOL npn -1216 20144 M0
SYMATTR InstName Q12
SYMATTR Value BC847B
SYMBOL npn -1440 20400 R0
SYMATTR InstName Q13
SYMATTR Value BC847B
SYMBOL npn -1536 20144 R0
SYMATTR InstName Q14
SYMATTR Value BC847B
SYMBOL Res -1392 20512 R0
SYMATTR InstName R13
SYMATTR Value 100
SYMBOL pnp -1408 19904 R180
WINDOW 0 60 32 Left 2
WINDOW 3 58 66 Left 2
SYMATTR InstName Q15
SYMATTR Value BC857B
SYMBOL Res -2768 20176 R90
WINDOW 0 0 56 VBottom 2
WINDOW 3 32 56 VTop 2
SYMATTR InstName R14
SYMATTR Value 1
SYMBOL npn -4560 20048 M0
SYMATTR InstName Q16
SYMATTR Value BC847B
SYMBOL Res -4640 20176 R0
SYMATTR InstName R15
SYMATTR Value 100
SYMBOL current -4624 19856 R0
SYMATTR InstName I8
SYMATTR Value 200Âµ
SYMBOL NE5532 -2192 20320 R0
SYMATTR InstName U1
SYMBOL Res -2144 20368 R0
SYMATTR InstName R4
SYMATTR Value 750
SYMBOL Res -2144 20544 R0
SYMATTR InstName R6
SYMATTR Value 100
SYMBOL pnp -848 19744 R180
WINDOW 0 60 32 Left 2
WINDOW 3 58 66 Left 2
SYMATTR InstName Q17
SYMATTR Value BC857B
SYMBOL pnp -784 19744 M180
WINDOW 0 64 34 Left 2
WINDOW 3 61 68 Left 2
SYMATTR InstName Q18
SYMATTR Value BC857B
SYMBOL pnp -784 19904 M180
WINDOW 0 64 34 Left 2
WINDOW 3 61 68 Left 2
SYMATTR InstName Q19
SYMATTR Value BC857B
SYMBOL npn -656 20144 M0
SYMATTR InstName Q20
SYMATTR Value BC847B
SYMBOL npn -880 20400 R0
SYMATTR InstName Q21
SYMATTR Value BC847B
SYMBOL npn -976 20144 R0
SYMATTR InstName Q22
SYMATTR Value BC847B
SYMBOL Res -832 20512 R0
SYMATTR InstName R2
SYMATTR Value 100
SYMBOL pnp -848 19904 R180
WINDOW 0 60 32 Left 2
WINDOW 3 58 66 Left 2
SYMATTR InstName Q23
SYMATTR Value BC857B
SYMBOL Res -544 20224 R0
SYMATTR InstName R5
SYMATTR Value 200
SYMBOL npn -4320 20048 M0
SYMATTR InstName Q24
SYMATTR Value BC847B
SYMBOL Res -4400 20176 R0
SYMATTR InstName R7
SYMATTR Value 100
SYMBOL current -4384 19856 R0
SYMATTR InstName I1
SYMATTR Value 200Âµ
SYMBOL Res -1856 20304 R0
SYMATTR InstName R10
SYMATTR Value 47
SYMBOL Cap -2112 21408 R90
WINDOW 0 0 32 VBottom 2
WINDOW 3 32 32 VTop 2
SYMATTR InstName C2
SYMATTR Value 1n
SYMBOL Cap -2112 21264 R90
WINDOW 0 0 32 VBottom 2
WINDOW 3 32 32 VTop 2
SYMATTR InstName C3
SYMATTR Value 100p
SYMBOL NE5532 -1904 21440 R0
SYMATTR InstName U2
SYMBOL Res -1856 21488 R0
SYMATTR InstName R16
SYMATTR Value 2k
SYMBOL Res -144 21520 R0
SYMATTR InstName R23
SYMATTR Value 300
SYMBOL Res -1856 21600 R0
SYMATTR InstName R24
SYMATTR Value 300
SYMBOL LM13700 -608 21216 R0
SYMATTR InstName U4
SYMBOL current -512 20976 R0
SYMATTR InstName I2
SYMATTR Value 500Âµ
SYMBOL current -752 20960 R0
SYMATTR InstName I3
SYMATTR Value 1.7Âµ
SYMBOL LM13700 -1392 21312 R0
SYMATTR InstName U6
SYMBOL current -1296 21072 R0
SYMATTR InstName I4
SYMATTR Value 1000Âµ
SYMBOL current -1536 21056 R0
SYMATTR InstName I5
SYMATTR Value 1.7Âµ
SYMBOL LM13700 -2784 21328 R0
SYMATTR InstName U7
SYMBOL current -2688 21088 R0
SYMATTR InstName I6
SYMATTR Value 1000Âµ
SYMBOL current -2928 21072 R0
SYMATTR InstName I7
SYMATTR Value 1.7Âµ
SYMBOL Res -1760 21136 R0
SYMATTR InstName R11
SYMATTR Value 2k
SYMBOL Res -1760 21248 R0
SYMATTR InstName R18
SYMATTR Value 33
SYMBOL LM13700 -1056 22736 R0
SYMATTR InstName U3
SYMBOL current -960 22496 R0
SYMATTR InstName I9
SYMATTR Value 400Âµ
SYMBOL current -1200 22480 R0
SYMATTR InstName I10
SYMATTR Value 0.7Âµ
SYMBOL Cap -912 22976 R0
SYMATTR InstName C5
SYMATTR Value 300p
SYMBOL LM13700 -1056 23552 R0
SYMATTR InstName U8
SYMBOL current -960 23312 R0
SYMATTR InstName I11
SYMATTR Value 400Âµ
SYMBOL current -1200 23296 R0
SYMATTR InstName I12
SYMATTR Value 0.7Âµ
SYMBOL Cap -912 23792 R0
SYMATTR InstName C6
SYMATTR Value 56p
SYMBOL NE5532 -1664 23152 R0
SYMATTR InstName U9
SYMBOL Res -1616 23344 R0
SYMATTR InstName R17
SYMATTR Value 8.2k
SYMBOL Res -1616 23488 R0
SYMATTR InstName R19
SYMATTR Value 30
SYMBOL Cap -1872 23152 R90
WINDOW 0 0 32 VBottom 2
WINDOW 3 32 32 VTop 2
SYMATTR InstName C7
SYMATTR Value 47p
SYMBOL Voltage -2224 23232 R0
SYMATTR InstName V4
SYMATTR Value PWL file=freq_sweep_100k_1500k.pwl
SYMBOL Res -1536 22864 R0
SYMATTR InstName R20
SYMATTR Value 10k
SYMBOL Res -1536 23008 R0
SYMATTR InstName R21
SYMATTR Value 75
SYMBOL Res -1936 23504 R0
SYMATTR InstName R22
SYMATTR Value 1000k
SYMBOL LM13700 -240 23264 R0
SYMATTR InstName U10
SYMBOL current -144 23024 R0
SYMATTR InstName I13
SYMATTR Value 30Âµ
SYMBOL Res -96 23488 R0
SYMATTR InstName R25
SYMATTR Value 4.2k
SYMBOL current 64 23600 R0
SYMATTR InstName I15
SYMATTR Value 700Âµ
SYMBOL Res -832 23680 R0
SYMATTR InstName R26
SYMATTR Value 4.7k
SYMBOL current -752 23824 R0
SYMATTR InstName I16
SYMATTR Value 50Âµ
SYMBOL Cap -656 23808 R0
SYMATTR InstName C8
SYMATTR Value 1n
SYMBOL current -752 23008 R0
SYMATTR InstName I14
SYMATTR Value 50Âµ
SYMBOL LM13700 1280 23808 R0
SYMATTR InstName U11
SYMBOL current 1376 23568 R0
SYMATTR InstName I17
SYMATTR Value 200Âµ
SYMBOL current 1136 23552 R0
SYMATTR InstName I18
SYMATTR Value 0.1Âµ
SYMBOL Cap 1424 24048 R0
SYMATTR InstName C9
SYMATTR Value 100p
SYMBOL NE5532 1792 23968 R0
SYMATTR InstName U12
SYMBOL Res 1840 24016 R0
SYMATTR InstName R27
SYMATTR Value 10k
SYMBOL Res 1840 24256 R0
SYMATTR InstName R28
SYMATTR Value 47
SYMBOL Res 2064 24016 R0
SYMATTR InstName R29
SYMATTR Value 10k
SYMBOL Res 2064 24160 R0
SYMATTR InstName R30
SYMATTR Value 390
SYMBOL LM13700 2544 23808 R0
SYMATTR InstName U13
SYMBOL current 2640 23568 R0
SYMATTR InstName I19
SYMATTR Value 200Âµ
SYMBOL current 2400 23552 R0
SYMATTR InstName I20
SYMATTR Value 0.1Âµ
SYMBOL Cap 2688 24048 R0
SYMATTR InstName C10
SYMATTR Value 100p
SYMBOL NE5532 3056 23968 R0
SYMATTR InstName U14
SYMBOL Res 3104 24016 R0
SYMATTR InstName R31
SYMATTR Value 10k
SYMBOL Res 3104 24256 R0
SYMATTR InstName R32
SYMATTR Value 47
SYMBOL Res 3328 24016 R0
SYMATTR InstName R33
SYMATTR Value 10k
SYMBOL Res 3328 24160 R0
SYMATTR InstName R34
SYMATTR Value 390
SYMBOL LM13700 2096 24928 R0
SYMATTR InstName U15
SYMBOL current 2192 24688 R0
SYMATTR InstName I21
SYMATTR Value 100Âµ
SYMBOL current 1952 24672 R0
SYMATTR InstName I22
SYMATTR Value 0.1Âµ
SYMBOL Res 2240 25152 R0
SYMATTR InstName R36
SYMATTR Value 240
SYMBOL Res 2240 25312 R0
SYMATTR InstName R37
SYMATTR Value 1
SYMBOL LM13700 3344 24912 R0
SYMATTR InstName U16
SYMBOL current 3440 24672 R0
SYMATTR InstName I23
SYMATTR Value 100Âµ
SYMBOL current 3200 24656 R0
SYMATTR InstName I24
SYMATTR Value 0.1Âµ
SYMBOL Res 3488 25136 R0
SYMATTR InstName R38
SYMATTR Value 240
SYMBOL Res 3488 25296 R0
SYMATTR InstName R39
SYMATTR Value 1
SYMBOL Res -1616 23200 R0
SYMATTR InstName R40
SYMATTR Value 2k
SYMBOL Cap -1808 24480 R90
WINDOW 0 0 32 VBottom 2
WINDOW 3 32 32 VTop 2
SYMATTR InstName C11
SYMATTR Value 1n
SYMBOL NE5532 -1584 24480 R0
SYMATTR InstName U17
SYMBOL LM13700 -1440 25008 R0
SYMATTR InstName U18
SYMBOL current -1344 24768 R0
SYMATTR InstName I25
SYMATTR Value 400Âµ
SYMBOL current -1584 24752 R0
SYMATTR InstName I26
SYMATTR Value 10Âµ
SYMBOL Res -1232 24384 R0
SYMATTR InstName R41
SYMATTR Value 200
SYMBOL Res -1232 24640 R0
SYMATTR InstName R42
SYMATTR Value 200
SYMBOL MCP6021 480 23152 R0
SYMATTR InstName U19
TEXT -5608 19232 Left 2 !.tran 0 8m 100u 10n
TEXT -7336 18888 Left 5 ;Theremin Current Sensing Oscillator with PLL.
TEXT -6440 19000 Left 3 ;Variable Frequency \nBandpass Filter.\nHas zero phase shift \non middle frequency.
TEXT -184 22784 Left 2 !.ic V(VGYR1)=2.24\n.ic V(VGYR2)=2.23
TEXT 1768 23680 Left 2 !.ic V(PP1)=3\n.ic V(PP2)=2

The netlist it stands for:
* vco_and_lc_drive_v12.asc
V1 COM 0 4.5
V2 VREF 0 2.25
L2 SENSE ANT 2mH Rser=120 Cpar=1pF
C_ant ANT 0 10pF
R35 N001 SENSE 3
V3 VREF12 0 1.2
Q105 VCOBIAS0 VCOBIAS0 N029 0 BC847B
R52 COM VCOBIAS0 10k
R53 N029 0 100
V6 VCCP 0 2.25
V7 0 VCCN 2.25
Q4 BUFBIASN BUFBIASN N018 0 BC847B
R1 N018 VCCN 100
R3 0 BUFBIASN 7.5k
Q1 N006 N003 COM 0 BC857B
Q2 N003 N003 COM 0 BC857B
Q3 PT1 N009 N003 0 BC857B
Q5 PT1 N015 N020 0 BC847B
Q6 N020 VCOBIAS11 N023 0 BC847B
Q7 N009 N014 N020 0 BC847B
R8 N023 0 100
Q8 N009 N009 N006 0 BC857B
C1 PT2 PT1 360p
C4 BPOUT2 PT1 100p
* U5: NE5532 (symbol NE5532 not available, pins judged from their places): In+=VREF In-=PT2 V+=COM V-=0 OUT=BPOUT2
R9 BPOUT2 N017 1500
R12 N016 VREF 30
Q9 N007 N004 COM 0 BC857B
Q10 N004 N004 COM 0 BC857B
Q11 PT2 N010 N004 0 BC857B
Q12 PT2 PT2 N021 0 BC847B
Q13 N021 VCOBIAS11 N024 0 BC847B
Q14 N010 N016 N021 0 BC847B
R13 N024 0 100
Q15 N010 N010 N007 0 BC857B
R14 N014 N002 1
Q16 VCOBIAS11 VCOBIAS11 N012 0 BC847B
R15 N012 0 100
I8 COM VCOBIAS11 200Âµ
* U1: NE5532 (symbol NE5532 not available, pins judged from their places): In+=PT1 In-=N019 V+=COM V-=0 OUT=N019
R4 N019 N015 750
R6 N015 VREF 100
Q17 N008 N005 COM 0 BC857B
Q18 N005 N005 COM 0 BC857B
Q19 N002 N011 N005 0 BC857B
Q20 N002 N017 N022 0 BC847B
Q21 N022 VCOBIAS0 N025 0 BC847B
Q22 N011 VREF N022 0 BC847B
R2 N025 0 100
Q23 N011 N011 N008 0 BC857B
R5 N002 VREF 200
Q24 VCOBIAS0 VCOBIAS0 N013 0 BC847B
R7 N013 0 100
I1 COM VCOBIAS0 200Âµ
R10 N017 N016 47
C2 PT22 PT11 1n
C3 BPOUT22 PT11 100p
* U2: NE5532 (symbol NE5532 not available, pins judged from their places): In+=VREF In-=PT22 V+=COM V-=0 OUT=BPOUT22
R16 BPOUT22 N033 2k
R23 N026 VREF 300
R24 N033 VREF 300
XU4 N027 NC_01 VREF N033 N026 0 NC_02 NC_03 COM LM13700/NS  ; pins Ibias Dio_bias in+ in- out V- buf_in buf_out V+
I2 COM N027 500Âµ
I3 COM N031 1.7Âµ
XU6 N028 NC_04 N032 PT22 PT22 0 NC_05 NC_06 COM LM13700/NS  ; pins Ibias Dio_bias in+ in- out V- buf_in buf_out V+
I4 COM N028 1000Âµ
I5 COM N034 1.7Âµ
XU7 N030 NC_07 N026 PT11 PT11 0 NC_08 NC_09 COM LM13700/NS  ; pins Ibias Dio_bias in+ in- out V- buf_in buf_out V+
I6 COM N030 1000Âµ
I7 COM N035 1.7Âµ
R11 BPOUT22 N032 2k
R18 N032 VREF 33
XU3 N036 N037 VREF N038 VGYR1 0 VGYR1 N040 COM LM13700/NS  ; pins Ibias Dio_bias in+ in- out V- buf_in buf_out V+
I9 COM N036 400Âµ
I10 COM N037 0.7Âµ
C5 VGYR1 0 300p
XU8 N045 N049 VGYR1 N047 VGYR2 0 N050 N054 COM LM13700/NS  ; pins Ibias Dio_bias in+ in- out V- buf_in buf_out V+
I11 COM N045 400Âµ
I12 COM N049 0.7Âµ
C6 NC_10 0 56p
* U9: NE5532 (symbol NE5532 not available, pins judged from their places): In+=VGYR2 In-=N042 V+=COM V-=0 OUT=N039
R17 N042 N047 8.2k
R19 N047 VREF 30
C7 VGYR2 N044 47p
V4 DRV 0 PWL file=freq_sweep_100k_1500k.pwl
R20 N039 N038 10k
R21 N038 VREF 75
R22 N048 VREF 1000k
XU10 N043 NC_11 VREF VGYR1 N046 0 N046 N044 COM LM13700/NS  ; pins Ibias Dio_bias in+ in- out V- buf_in buf_out V+
I13 COM N043 30Âµ
R25 N046 VREF 4.2k
I15 N044 0 700Âµ
R26 N050 VREF 4.7k
I16 N054 0 50Âµ
C8 N054 0 1n
I14 N040 0 50Âµ
XU11 N051 N055 AMP2 N059 PP1 0 NC_12 NC_13 COM LM13700/NS  ; pins Ibias Dio_bias in+ in- out V- buf_in buf_out V+
I17 COM N051 200Âµ
I18 COM N055 0.1Âµ
C9 PP1 0 100p
* U12: NE5532 (symbol NE5532 not available, pins judged from their places): In+=PP1 In-=N057 V+=COM V-=0 OUT=N057
R27 N057 N059 10k
R28 N059 VREF 47
R29 N057 DIV1 10k
R30 DIV1 VREF 390
XU13 N052 N056 N053 AMP1 PP2 0 NC_14 NC_15 COM LM13700/NS  ; pins Ibias Dio_bias in+ in- out V- buf_in buf_out V+
I19 COM N052 200Âµ
I20 COM N056 0.1Âµ
C10 PP2 0 100p
* U14: NE5532 (symbol NE5532 not available, pins judged from their places): In+=PP2 In-=N058 V+=COM V-=0 OUT=N058
R31 N058 N053 10k
R32 N053 VREF 47
R33 N058 DIV2 10k
R34 DIV2 VREF 390
XU15 N064 N067 DIV1 N069 AMP1 0 NC_16 NC_17 COM LM13700/NS  ; pins Ibias Dio_bias in+ in- out V- buf_in buf_out V+
I21 COM N064 100Âµ
I22 COM N067 0.1Âµ
R36 AMP1 N069 240
R37 N069 VREF 1
XU16 N063 N066 DIV2 N068 AMP2 0 NC_18 NC_19 COM LM13700/NS  ; pins Ibias Dio_bias in+ in- out V- buf_in buf_out V+
I23 COM N063 100Âµ
I24 COM N066 0.1Âµ
R38 AMP2 N068 240
R39 N068 VREF 1
R40 N039 N042 2k
C11 N061 DRV 1n
* U17: NE5532 (symbol NE5532 not available, pins judged from their places): In+=N061 In-=N060 V+=COM V-=0 OUT=N060
XU18 N065 NC_20 VREF N062 N061 0 NC_21 NC_22 COM LM13700/NS  ; pins Ibias Dio_bias in+ in- out V- buf_in buf_out V+
I25 COM N065 400Âµ
I26 COM N070 10Âµ
R41 N060 N062 200
R42 N062 VREF 200
XU19 NC_23 N041 COM 0 N041 MCP6021  ; pins In+ In- V+ V- OUT
.model NPN NPN
.model PNP PNP
.lib standard.bjt
.tran 0 8m 100u 10n
* Theremin Current Sensing Oscillator with PLL.
* Variable Frequency
* Bandpass Filter.
* Has zero phase shift
* on middle frequency.
.ic V(VGYR1)=2.24
.ic V(VGYR2)=2.23
.ic V(PP1)=3
.ic V(PP2)=2
.lib ns_models.lib
.lib MCP6021.cir
.backanno
.end